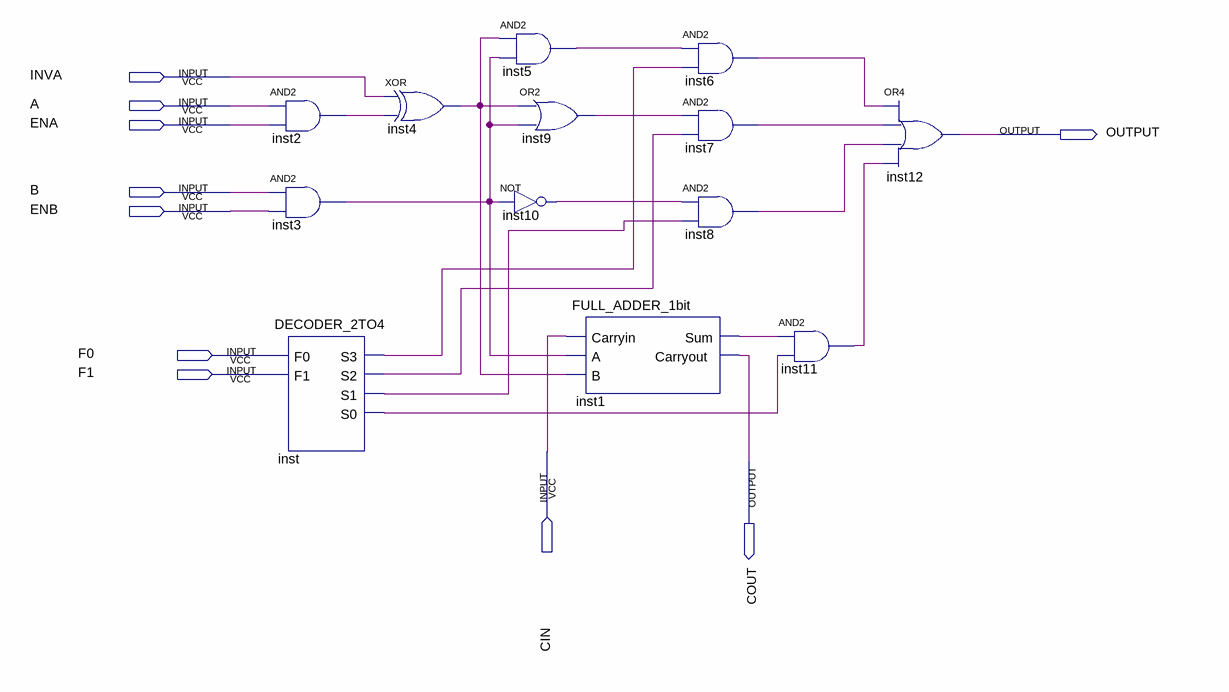
[diagram p0: schematic sheet]
// Quartus schematic ULA_1bit.bdf as structural Verilog: 13 symbols, 10 pins
module ULA_1bit (
  input  INVA,
  input  A,
  input  ENA,
  input  B,
  input  ENB,
  input  F0,
  input  F1,
  input  CIN,
  output OUTPUT,
  output COUT
);

  wire inst1_sum, inst2_out, inst3_out, inst4_out, inst5_out, inst6_out, inst7_out, inst8_out, inst9_out,
       inst10_out, inst11_out, inst_s0, inst_s1, inst_s2, inst_s3;

  and inst2 (inst2_out, A, ENA);
  and inst3 (inst3_out, B, ENB);
  DECODER_2TO4 inst (.S3(inst_s3), .S2(inst_s2), .S1(inst_s1), .S0(inst_s0));  // open: F0, F1
  xor inst4 (inst4_out, INVA, inst2_out);
  and inst5 (inst5_out, inst4_out, inst3_out);
  or inst9 (inst9_out, inst4_out, inst3_out);
  not inst10 (inst10_out, inst3_out);
  FULL_ADDER_1bit inst1 (.Carryin(CIN), .A(inst3_out), .B(inst4_out), .Sum(inst1_sum), .Carryout(COUT));
  and inst6 (inst6_out, inst5_out, inst_s3);
  and inst7 (inst7_out, inst9_out, inst_s2);
  and inst8 (inst8_out, inst10_out, inst_s1);
  and inst11 (inst11_out, inst1_sum, inst_s0);
  or inst12 (OUTPUT, inst6_out, inst7_out, inst8_out, inst11_out);
endmodule
